# Altium schematic sheet presure_sensor.SchDoc
size A
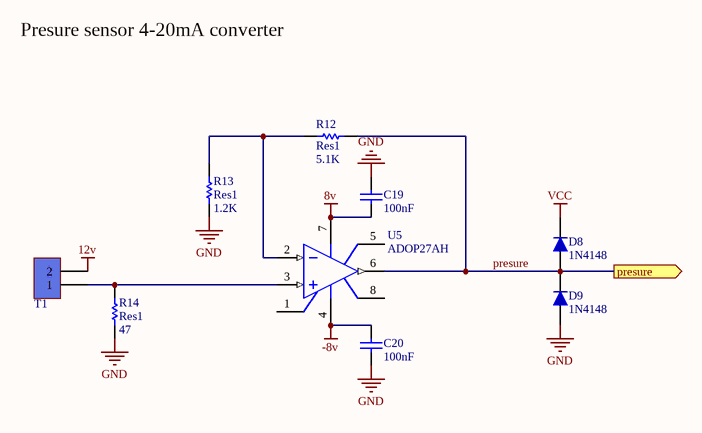
[diagram p0: presure_sensor.SchDoc]

## Parts
C19  value 100nF  [CAP 1206 (3216X15L)]  (hidden comment: Cap)
C20  value 100nF  [CAP 1206 (3216X15L)]  (hidden comment: Cap)
D8  1N4148  [LL4148]
D9  1N4148  [LL4148]
R12  Res1  value 5.1K  [RES 1206 (3216X08L)]
R13  Res1  value 1.2K  [RES 1206 (3216X08L)]
R14  Res1  value 47  [RES 1206 (3216X08L)]
T1  Terminal  [Terminal 1*2]  (value not drawn)
U5  ADOP27AH  [SOIC8-Narrow]

## Ports
presure (out)

## Nets
8v: C19.1 U5.7(V+)
12v: T1.2
-8v: C20.2 U5.4(V-)
GND: C19.2 C20.1 D9.1 R13.1 R14.1
VCC: D8.2
presure: D8.1 D9.2 R12.2 U5.6(OUT) ; port presure
NetR12_1: R12.1 R13.2 U5.2(IN-)
NetR14_2: R14.2 T1.1 U5.3(IN+)

Not connected (* = marked no-connect by the designer): U5 1(OS_NULL) 5(NC) 8(OS_NULL)

## Notes on the sheet
- Presure sensor 4-20mA converter

## Library data of the parts
C19 C20 = Cap ceramic: CAP-100Nf
D8 D9 = 1N4148: DIODE GEN PURP 100V 200MA DO35; Published: 2017-1-12; PackageVersion: 2017-1-12; PackageReference: DO 35; Publisher: Abbas Basereh; PackageDescription: DIODE GEN PURP 100V 200MA DO35; ComponentLink1Description: Manufacturer Link; ComponentLink1URL: http://www.digikey.com/product-detail/en/fairchild-on-semiconductor/1N4148/1N4148FS-ND/458603; ComponentLink2Description: Datasheet; PART.NO: 1N4148
R12-R14 = Res1: Resistor; Published: 8-Jun-2000; LatestRevisionDate: 17-Jul-2002; LatestRevisionNote: Re-released for DXP Platform.; PackageReference: AXIAL-0.3; Publisher: Altium Limited; PackageDescription: Axial Device, Thru-Hole; 2 Leads; 0.3 in Pin Spacing
T1 = Terminal 1*2: Terminal 2 Pin 250VAC 16A; Designer: Seyed Mohsen Ghasemain; E-mail: picpars@gmail.com; ComponentLinkURL: www.picpars.com
U5 = ADOP27AH: Ultra-Low Noise, Precision Operational Amplifier; Note: Pin 5 is not connected; Pin 4 connected to case.; Published: 8-Jun-2000; LatestRevisionDate: 17-Jul-2002; LatestRevisionNote: Re-released for DXP Platform.; DatasheetVersion: 1992; PackageVersion: 1990; PackageReference: H-08A; Publisher: Altium Limited; PackageDescription: Can; 8 Leads; Pin Circle Dia. 5.08 mm; Lead Dia. 0.53 mm (max); ComponentLink1Description: Manufacturer Link; ComponentLink1URL: http://www.analog.com/